# EAGLE design G1Tech-MAX31855K_v01 (EAGLE 9.0.0)
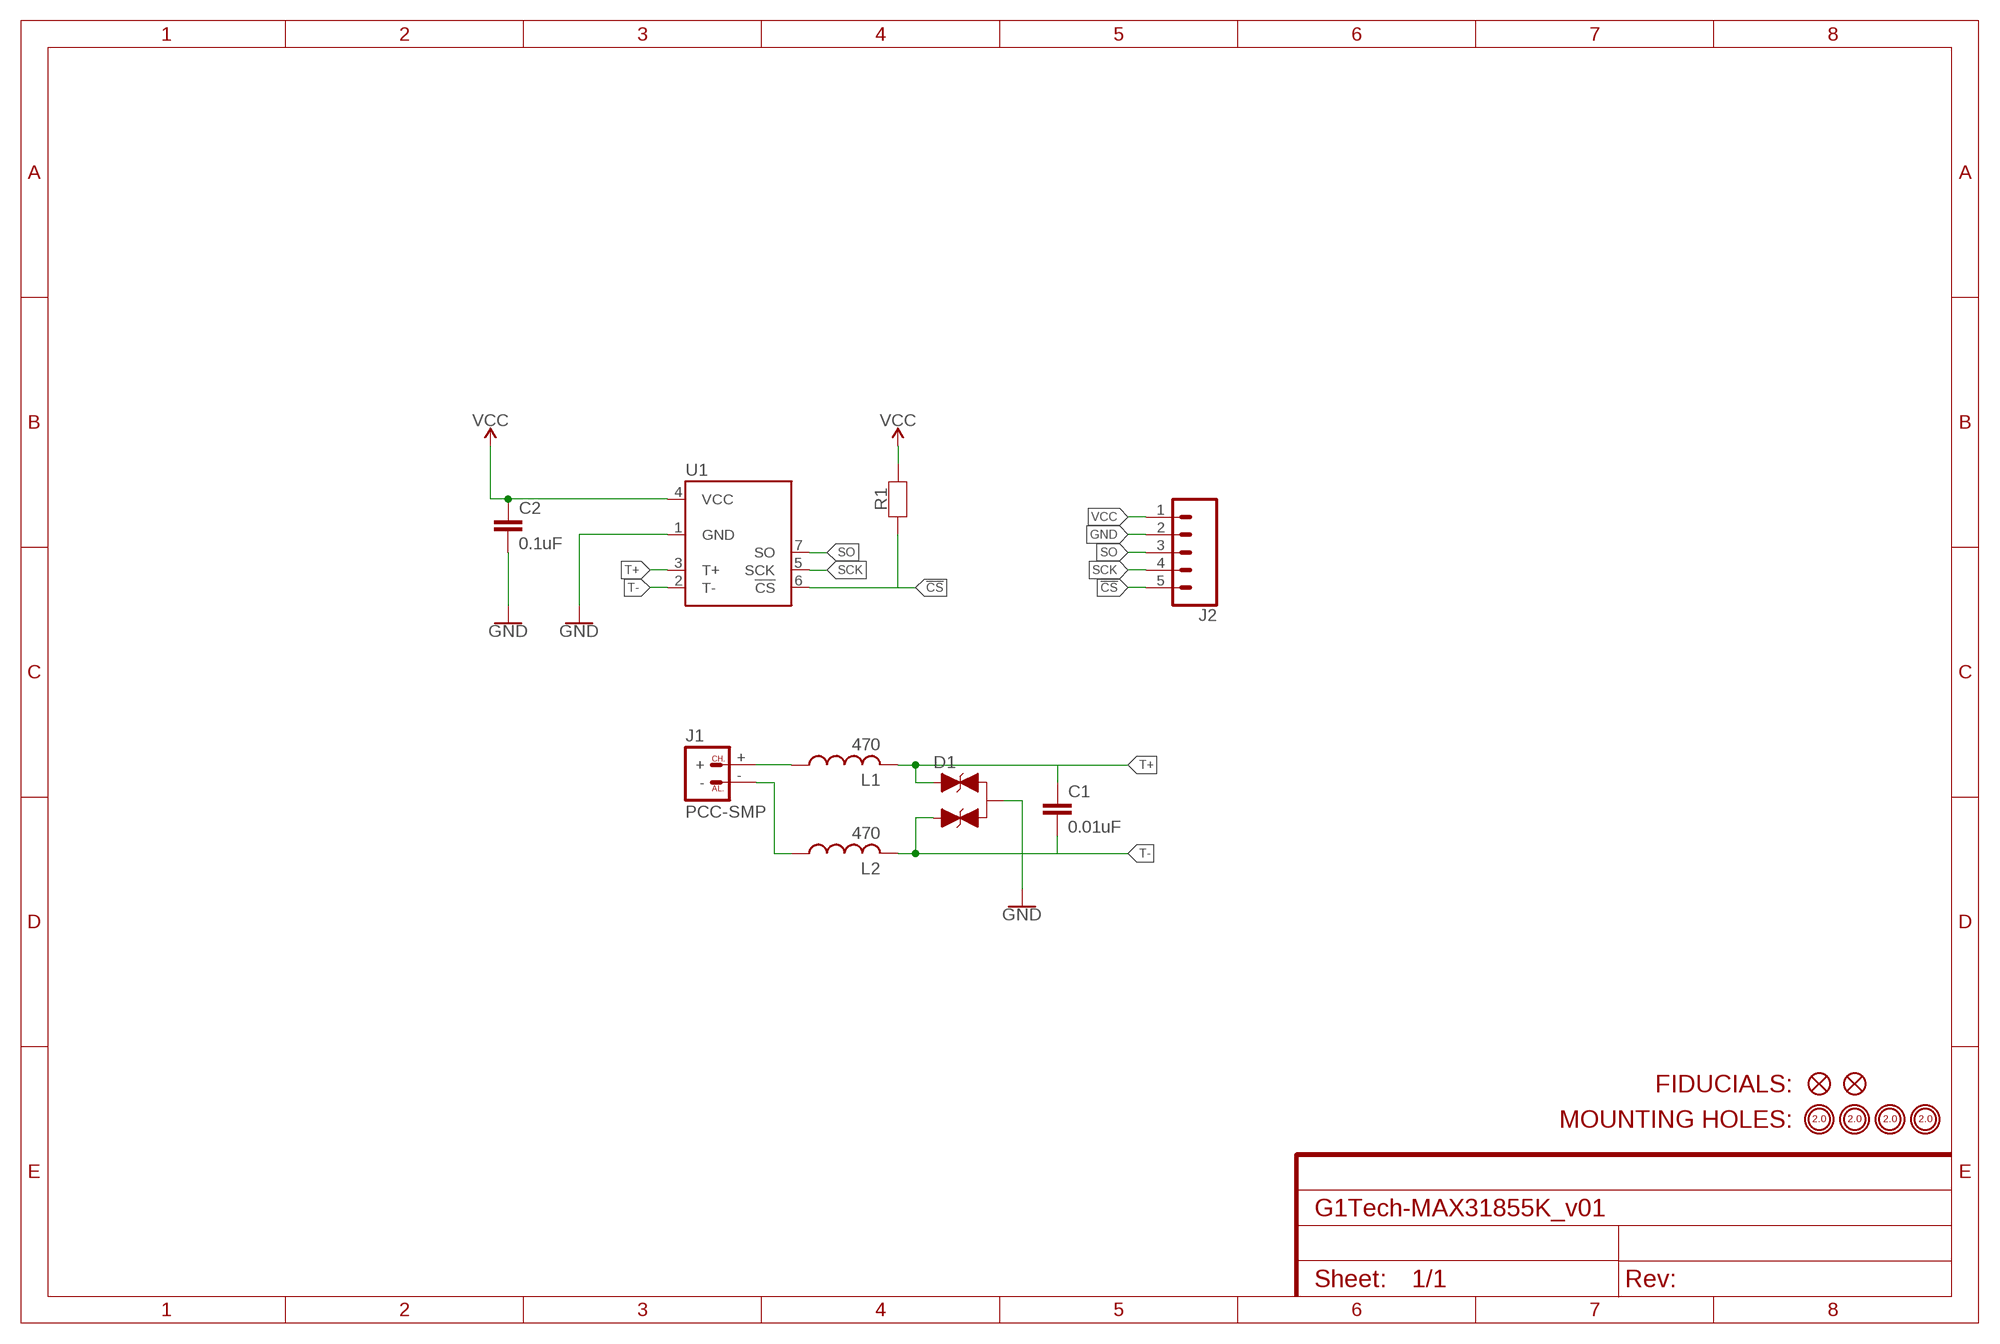
[diagram p0: schematic, sheet 1]

## Parts
C1  0.01uF  C0603  [C0603]
C2  0.1uF  C0603  [C0603]
D1  DIODE-TVS-NUP2105L  [SOT23-3]
FD1  FIDUCIAL-1X2  [FIDUCIAL-1X2]
FD2  FIDUCIAL-1X2  [FIDUCIAL-1X2]
H1  MOUNTINGHOLE-PLATED-2.0  [MOUNTINGHOLE-PLATED-2.0]
H2  MOUNTINGHOLE-PLATED-2.0  [MOUNTINGHOLE-PLATED-2.0]
H3  MOUNTINGHOLE-PLATED-2.0  [MOUNTINGHOLE-PLATED-2.0]
H4  MOUNTINGHOLE-PLATED-2.0  [MOUNTINGHOLE-PLATED-2.0]
J1  PCC-SMP  [PCC-SMP]
J2  CONN-1X5  [1X05_NO_SILK]
L1  470  FERRITE-BEADS-BLM18PG471SN1D  [MURATA-L0603]
L2  470  FERRITE-BEADS-BLM18PG471SN1D  [MURATA-L0603]
R1  YAGEO-R0603  [YAGEO-R0603]
U1  MAX31855KASA+  [SO08]

## Nets
!CS: J2.5 R1.1 U1.6(!CS)
GND: C2.2 D1.3 J2.2 U1.1(GND)
N$1: J1.+ L1.1
N$2: J1.- L2.1
SCK: J2.4 U1.5(SCK)
SO: J2.3 U1.7(SO)
T+: C1.1 D1.1 L1.2 U1.3(T+)
T-: C1.2 D1.2 L2.2 U1.2(T-)
VCC: C2.1 J2.1 R1.2 U1.4(VCC)

## Library data of the parts
C1 C2 = G1Tech-Capacitors:C0603
D1 = G1Tech-DiscreteSemi:DIODE-TVS-NUP2105L
FD1 FD2 = G1Tech-Design:FIDUCIAL-1X2
H1-H4 = G1Tech-Design:MOUNTINGHOLE-PLATED-2.0
J1 = G1Tech-Connectors:PCC-SMP
J2 = G1Tech-Connectors:CONN-1X5
L1 L2 = G1Tech-Coils:FERRITE-BEADS-BLM18PG471SN1D
R1 = G1Tech-Resistors:YAGEO-R0603: YAGEO Resistor R0603
U1 = G1Tech-IC-Conversion:MAX31855KASA+: https://datasheets.maximintegrated.com/en/ds/MAX31855.pdf

## Board
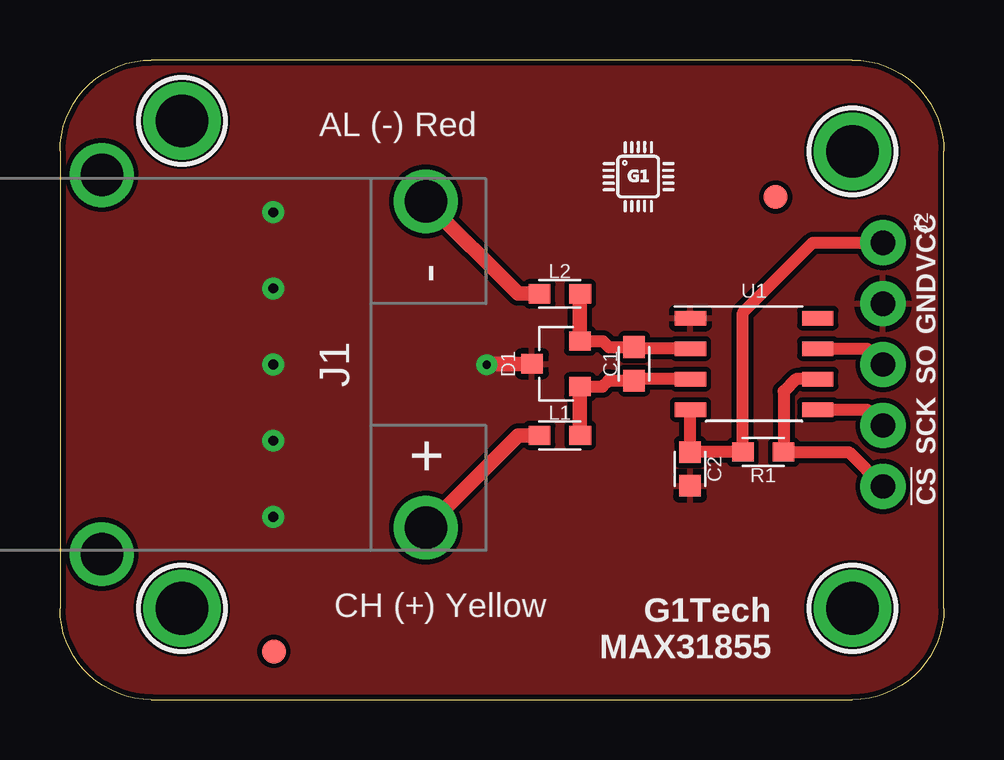
[diagram p1: board, top side]
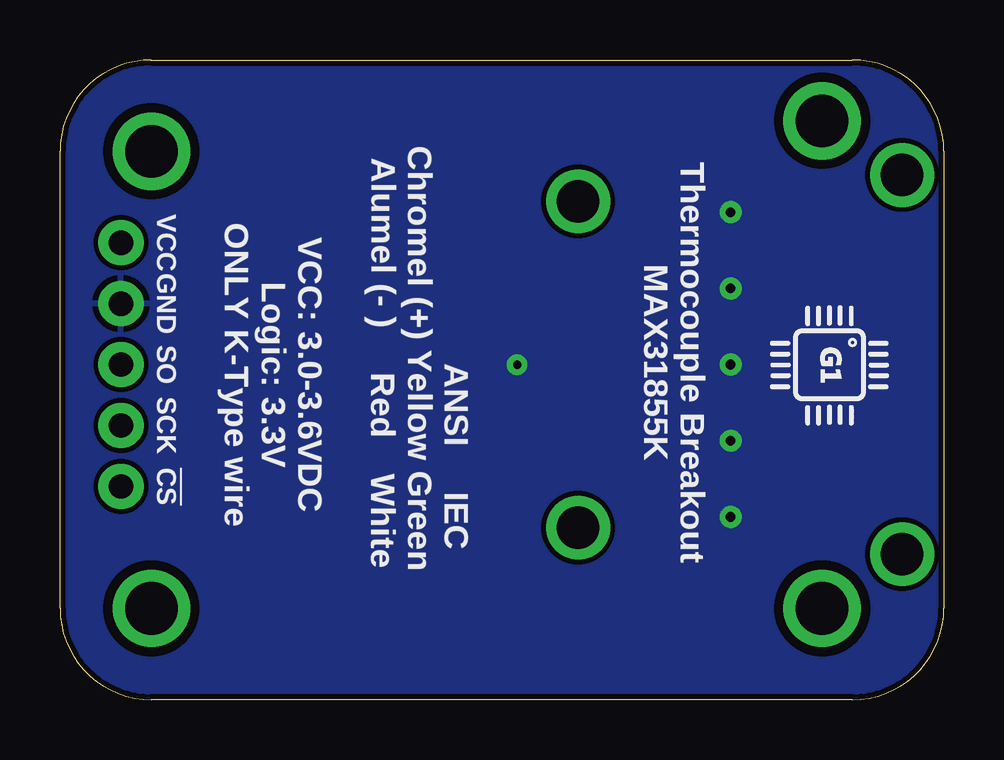
[diagram p2: board, bottom side, seen from below]

Size 36.83 x 26.67 mm. Coordinates in mm from the lower left corner, seen from the top.
Outline: 3.81,0 33.02,0 arc90 36.83,3.81 36.83,22.86 arc90 33.02,26.67 3.81,26.67 arc90 0,22.86 0,3.81 arc90 3.81,0
Copper layers (1*16): Top 0.035mm / dielectric 1.5mm / Bottom 0.035mm
Design rules "SparkFun": minimum track width 8mil, minimum drill 20mil, track to track 8mil, track to pad 8mil, pad to pad 8mil, via to via 8mil, smd to smd 8mil, copper to edge 9mil, drill to drill 8mil, minimum pad ring 12mil, minimum via ring 10mil, stop-mask expansion 4mil, vias tented up to drill 20mil, thermal gap 10mil

### Footprints (pad centres in the part's own frame; a part is rotated, then mirrored left to right if it is on the bottom)
C0603 = smd 0.9 x 0.9: 1 -0.7,0; 2 0.7,0
SOT23-3 = smd 0.8 x 0.9: 1 -0.95,-1; 2 0.95,-1; 3 0,1
FIDUCIAL-1X2 = smd 1 x 1: 1 0,0
MOUNTINGHOLE-PLATED-2.0 = drill 2.2: P$1 0,0
PCC-SMP = drill 1.77: + 6.8,0; - -6.8,0; MOUNT1 -7.9,-13.5; MOUNT2 7.9,-13.5
1X05_NO_SILK = drill 1.016 pad 1.88: 1 0,0; 2 2.54,0; 3 5.08,0; 4 7.62,0; 5 10.16,0
MURATA-L0603 = smd 0.9 x 0.8: 1 -0.85,0; 2 0.85,0
YAGEO-R0603 = smd 0.9 x 0.8: 1 -0.85,0; 2 0.85,0
SO08 = smd 0.6 x 1.3: 1 -1.905,-2.65; 2 -0.635,-2.65; 3 0.635,-2.65; 4 1.905,-2.65; 5 1.905,2.65; 6 0.635,2.65; 7 -0.635,2.65; 8 -1.905,2.65

### Placement (x,y rotation side)
C1  23.92,14 90 top
C2  26.25,9.62 270 top
D1  20.67,14 90 top
FD1  8.91,2.01 0 top
FD2  29.82,20.96 0 top
H1  5.08,3.81 0 top
H2  33.02,3.81 0 top
H3  5.08,24.13 0 top
H4  33.02,22.86 0 top
J1  15.24,13.97 270 top
J2  34.29,19.05 270 top
L1  20.83,11.02 0 top
L2  20.83,16.92 0 top
R1  29.3,10.32 180 top
U1  28.92,14 270 top
U$1  [LOGO-G1TECH-5MM]  7.24,16.43 270 bottom
U$2  [LOGO-G1TECH-3MM]  22.61,20.32 0 top

### Tracks (layer width: path | path; a pad name or v marks a point on that pad's centre or on a via)
!CS
  Top 0.508: U1.6 30.66,13.37 30.15,12.85 R1.1 | R1.1 | R1.1 32.86,10.32 J2.5
GND  (via drill 0.35, 0.41)
  Top 0.61: D1.3 17.81,14 v17.78,13.97
  other vias: 8.89,20.32 8.89,17.14 8.89,13.97 8.89,10.79 8.89,7.62
  pour Top: 0,0 0,26.67 36.83,26.67 36.83,0
  pour Bottom: 0,0 0,26.67 36.83,26.67 36.83,0
N$1
  Top 0.61: J1.+ 19.09,11.02 L1.1
N$2
  Top 0.61: J1.- 19.09,16.92 L2.1
SCK
  Top 0.508: U1.5 33.62,12.1 J2.4
SO
  Top 0.508: U1.7 33.62,14.63 J2.3
T+
  Top 0.508: D1.1 22.6,13.05 22.86,13.31 C1.1 | C1.1 | U1.3 23.97,13.37 C1.1
  Top 0.61: L1.2 21.67,11.03 D1.1
T-
  Top 0.508: D1.2 22.62,14.95 22.87,14.7 C1.2 23.98,14.63 U1.2
  Top 0.61: L2.2 21.67,16.91 D1.2
VCC
  Top 0.508: J2.1 31.37,19.05 28.45,16.13 R1.2 C2.1 26.25,12.08 U1.4

### Text on the board
tPlace: AL (-) Red | VCC | GND | SO | SCK | !CS | CH (+) Yellow | G1Tech / MAX31855
bPlace: Chromel (+) / Alumel (- ) | VCC | GND | Thermocouple Breakout / MAX31855K | VCC: 3.0-3.6VDC / Logic: 3.3V / ONLY K-Type wire | SO | ANSI / Yellow / Red | SCK | !CS | IEC / Green / White